# Altium schematic sheet 03_MCU.SchDoc
size A4; ApprovedBy: Doo; CheckedBy: Doo; DocumentNumber: PIF_C24_VRS02; Revision: RV_01; SheetNumber: 3; SheetTotal: 5
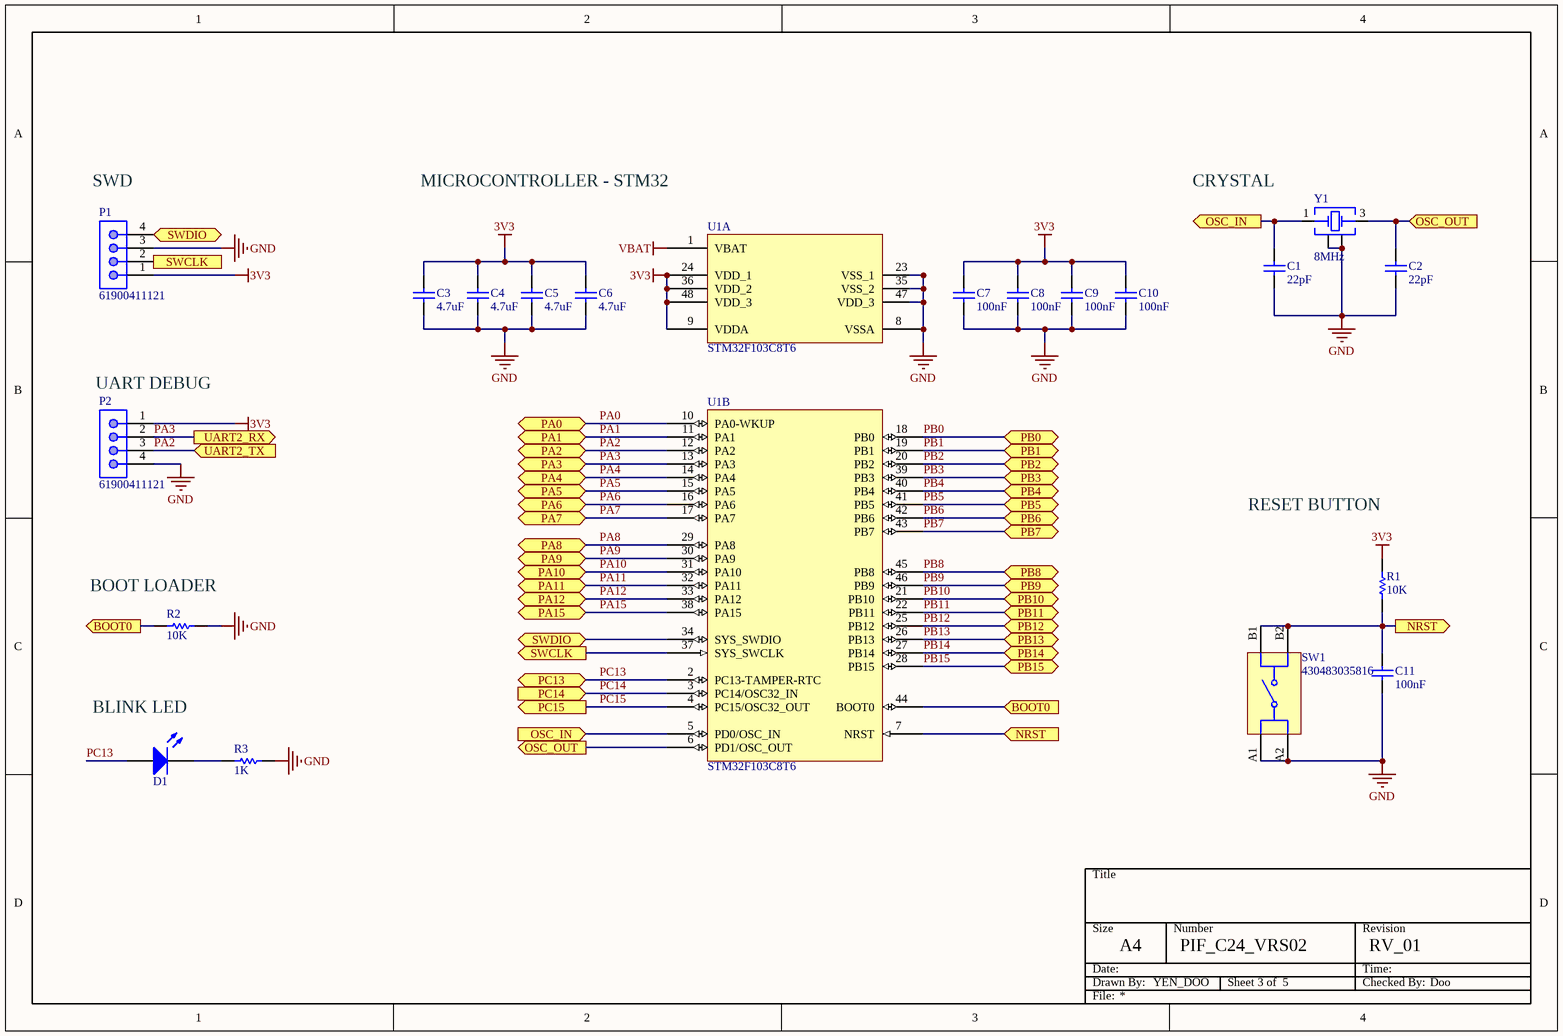
[diagram p0: 03_MCU.SchDoc]

## Parts
C1  value 22pF  [CAP-SM-0805]  (hidden comment: Cap Non-Pol SMD)
C2  value 22pF  [CAP-SM-0805]  (hidden comment: Cap Non-Pol SMD)
C3  value 4.7uF  [CAP-SM-0805]  (hidden comment: Cap Non-Pol SMD)
C4  value 4.7uF  [CAP-SM-0805]  (hidden comment: Cap Non-Pol SMD)
C5  value 4.7uF  [CAP-SM-0805]  (hidden comment: Cap Non-Pol SMD)
C6  value 4.7uF  [CAP-SM-0805]  (hidden comment: Cap Non-Pol SMD)
C7  value 100nF  [CAP-SM-0805]  (hidden comment: Cap Non-Pol SMD)
C8  value 100nF  [CAP-SM-0805]  (hidden comment: Cap Non-Pol SMD)
C9  value 100nF  [CAP-SM-0805]  (hidden comment: Cap Non-Pol SMD)
C10  value 100nF  [CAP-SM-0805]  (hidden comment: Cap Non-Pol SMD)
C11  value 100nF  [CAP-SM-0805]  (hidden comment: Cap Non-Pol SMD)
D1  LED SMD  [LED_0805_Blue]  (value not drawn)
P1  61900411121  [61900411121]
P2  61900411121  [61900411121]
R1  value 10K  [RES-SM-0805]  (hidden comment: RESISTOR SMD)
R2  value 10K  [RES-SM-0805]  (hidden comment: RESISTOR SMD)
R3  value 1K  [RES-SM-0805]  (hidden comment: RESISTOR SMD)
SW1  430483035816  [WS-TASV_L6W6H3.5_4304x30358x6]
U1  STM32F103C8T6  [LQFP48]  (parts A,B of 2)
Y1  8MHz  [WE-XTAL_CFPX-104]

## Ports
BOOT0 (in), BOOT0 (out), NRST (in), NRST (out), OSC_IN (in), OSC_IN (out), OSC_OUT (in), OSC_OUT (out), PA0 (bidir), PA1 (bidir), PA2 (bidir), PA3 (bidir), PA4 (bidir), PA5 (bidir), PA6 (bidir), PA7 (bidir), PA8 (bidir), PA9 (bidir), PA10 (bidir), PA11 (bidir), PA12 (bidir), PA15 (bidir), PB0 (bidir), PB1 (bidir), PB2 (bidir), PB3 (bidir), PB4 (bidir), PB5 (bidir), PB6 (bidir), PB7 (bidir), PB8 (bidir), PB9 (bidir), PB10 (bidir), PB11 (bidir), PB12 (bidir), PB13 (bidir), PB14 (bidir), PB15 (bidir), PC13 (bidir), PC14 (in), PC15 (out), SWCLK (in), SWCLK (out), SWDIO (bidir), UART2_RX (out), UART2_TX (in)

## Nets
3V3: C3.2 C4.2 C5.2 C6.2 C7.2 C8.2 C9.2 C10.2 P1.1 P2.1 R1.2 U1.9(VDDA) U1.24(VDD_1) U1.36(VDD_2) U1.48(VDD_3)
GND: C1.1 C2.1 C3.1 C4.1 C5.1 C6.1 C7.1 C8.1 C9.1 C10.1 C11.1 P1.3 P2.4 R2.1 R3.1 SW1.A1 SW1.A2 U1.8(VSSA) U1.23(VSS_1) U1.35(VSS_2) U1.47(VDD_3) Y1.2(GND) Y1.4(GND)
VBAT: U1.1(VBAT)
BOOT0: R2.2 U1.44(BOOT0) ; port BOOT0
NRST: C11.2 R1.1 SW1.B1 SW1.B2 U1.7(NRST) ; port NRST
OSC_IN: C1.2 U1.5(PD0/OSC_IN) Y1.1(OSC1) ; port OSC_IN
OSC_OUT: C2.2 U1.6(PD1/OSC_OUT) Y1.3(OSC2) ; port OSC_OUT
PA0: U1.10(PA0-WKUP) ; port PA0
PA1: U1.11(PA1) ; port PA1
PA2: P2.3 U1.12(PA2) ; port PA2, port UART2_TX
PA3: P2.2 U1.13(PA3) ; port PA3, port UART2_RX
PA4: U1.14(PA4) ; port PA4
PA5: U1.15(PA5) ; port PA5
PA6: U1.16(PA6) ; port PA6
PA7: U1.17(PA7) ; port PA7
PA8: U1.29(PA8) ; port PA8
PA9: U1.30(PA9) ; port PA9
PA10: U1.31(PA10) ; port PA10
PA11: U1.32(PA11) ; port PA11
PA12: U1.33(PA12) ; port PA12
PA15: U1.38(PA15) ; port PA15
PB0: U1.18(PB0) ; port PB0
PB1: U1.19(PB1) ; port PB1
PB2: U1.20(PB2) ; port PB2
PB3: U1.39(PB3) ; port PB3
PB4: U1.40(PB4) ; port PB4
PB5: U1.41(PB5) ; port PB5
PB6: U1.42(PB6) ; port PB6
PB7: U1.43(PB7) ; port PB7
PB8: U1.45(PB8) ; port PB8
PB9: U1.46(PB9) ; port PB9
PB10: U1.21(PB10) ; port PB10
PB11: U1.22(PB11) ; port PB11
PB12: U1.25(PB12) ; port PB12
PB13: U1.26(PB13) ; port PB13
PB14: U1.27(PB14) ; port PB14
PB15: U1.28(PB15) ; port PB15
PC13: D1.1(A) U1.2(PC13-TAMPER-RTC) ; port PC13
PC14: U1.3(PC14/OSC32_IN) ; port PC14
PC15: U1.4(PC15/OSC32_OUT) ; port PC15
SWCLK: P1.2 U1.37(SYS_SWCLK) ; port SWCLK
SWDIO: P1.4 U1.34(SYS_SWDIO) ; port SWDIO
NetD1_2: D1.2(K) R3.2

## Notes on the sheet
- (near P1) SWD
- MICROCONTROLLER - STM32
- CRYSTAL
- (near P2) UART DEBUG
- RESET BUTTON
- (near R2) BOOT LOADER
- BLINK LED
- Title
- Size
- Date:
- Drawn By:
- A4
- YEN_DOO
- Number
- Revision
- Checked By:
- Time:
- File:

## Library data of the parts
C1-C11 = Cap Non-Pol SMD: Capacitor
D1 = LED SMD: LED
P1 P2 = 61900411121: WR-WTB THT Male Vertical Locking Header, pitch 2.54mm, 4p; Pin Number: 4; Contact Resistance: 20mOhm; Rated Current: 3A; Withstanding Voltage: 1000VAC; Working Voltage: 250VAC; ComponentLink1Description: Manufacturer; ComponentLink1URL: http://www.we-online.de; ComponentLink2Description: Datasheet; ComponentLink2URL: https://www.we-online.com/catalog/datasheet/61900411121.pdf; Pitch: 2.54mm; Published Date: January 2020; Publisher: Wurth Elektronik; Mounting Technology: THT; Packaging: Bag; Operating Temperature: -40 to +105degC; Part Number: 61900411121; Gender: Male; Type: Vertical
R1-R3 = RESISTOR SMD: Resistor
SW1 = 430483035816: WS-TASV J-Bend SMT Washable Tact Switch, 12VDC, 50mA, 160g, height 3.5mm; Manufacturer: Wurth Elektronik; Rated Voltage: 12V; Washable: Yes; Actuator Color: Black; Electrical Life: 1000000Cycles; ComponentLink1Description: Manufacturer Link; ComponentLink1URL: http://www.we-online.de; ComponentLink2Description: Datasheet; ComponentLink2URL: https://www.we-online.com/catalog/datasheet/430483035816.pdf; Manufacturer Part Number: 430483035816; Contact Material: Stainless Steel; Mounting Technology: SMT; Contact Plating: Silver; Operation Force: 160g; Packaging: Tape and Reel; Terminal Material: Copper Alloy; Rated Current: 50mA; Terminal Plating: Silver; Height: 3.5mm; Length: 6mm; Operating Temperature max.: 85C; Operating Temperature min.: -40C; Width: 6mm
U1 = STM32F103C8T6: ARM Microcontrollers - MCU 32BIT Cortex M3 64KB 20KB RAM 2X12 ADC; Manufacturer: STMicroelectronics; Core: ARM Cortex M3; ADC Resolution: 12 bit; Maximum Clock Frequency: 72 MHz; Number of I/Os: 37 I/O; Supply Voltage - Min: 2 V; Supply Voltage - Max: 3.6 V; Interface Type: CAN, I2C, SPI, USART, USB; Data RAM Type: SRAM; Number of ADC Channels: 10 Channel; Number of Timers/Counters: 3 Timer; Processor Series: ARM Cortex M; Product Category: ARM Microcontrollers - MCU; Series: STM32F103C8; Mounting Style: SMD/SMT; Package / Case: LQFP-48; Program Memory Size: 64 kB; Data Bus Width: 32 bit; Data RAM Size: 20 kB; Minimum Operating Temperature: - 40 C; Maximum Operating Temperature: + 85 C; Length: 7 mm; ComponentLink1Description: Datasheet; ComponentLink1URL: https://www.mouser.vn/datasheet/2/389/stm32f103c8-1851025.pdf
Y1 = 830106162701: WE-XTAL Quartz Crystal, SMT, CFPX-104, 8MHz, +/-20ppm; Manufacturer: Wurth Elektronik; Frequency Stability: +/-30ppm; Load Capacitance: 16pF; ComponentLink1Description: Manufacturer; ComponentLink1URL: http://www.we-online.de; ComponentLink2Description: Datasheet; ComponentLink2URL: https://www.we-online.com/catalog/datasheet/830106162701.pdf; Operating Temperature: -40 to +85degC; Packaging: Tape and Reel; Manufacturer Part Number: 830106162701; Published Date: November 2020; Size: CFPX-104; Frequency: 8MHz; Frequency Tolerance: +/-20ppm; Mounting Technology: SMT